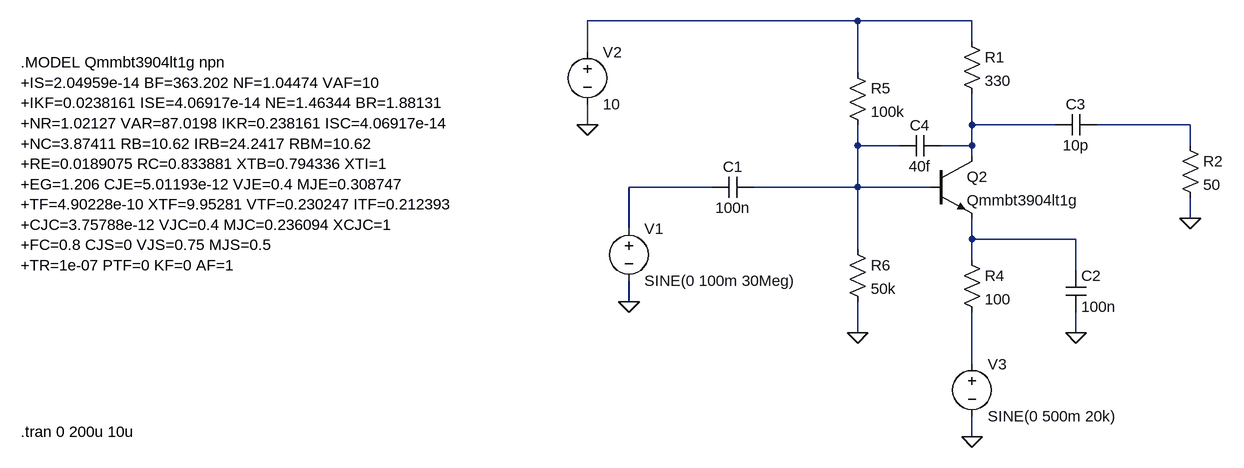
[diagram p0: schematic Mixer.asc]
Mixer.asc, the LTspice schematic file:
Version 4
SHEET 1 2992 1448
WIRE 1344 48 928 48
WIRE 1520 48 1344 48
WIRE 1520 80 1520 48
WIRE 928 96 928 48
WIRE 1344 128 1344 48
WIRE 928 208 928 176
WIRE 1520 208 1520 160
WIRE 1648 208 1520 208
WIRE 1856 208 1712 208
WIRE 1344 240 1344 208
WIRE 1408 240 1344 240
WIRE 1520 240 1520 208
WIRE 1520 240 1472 240
WIRE 1856 240 1856 208
WIRE 1520 256 1520 240
WIRE 1120 304 992 304
WIRE 1344 304 1344 240
WIRE 1344 304 1184 304
WIRE 1456 304 1344 304
WIRE 1856 352 1856 320
WIRE 992 368 992 304
WIRE 1520 384 1520 352
WIRE 1680 384 1520 384
WIRE 1344 400 1344 304
WIRE 1520 416 1520 384
WIRE 1680 432 1680 384
WIRE 992 480 992 448
WIRE 1344 528 1344 480
WIRE 1680 528 1680 496
WIRE 1520 576 1520 496
WIRE 1520 688 1520 656
FLAG 1344 528 0
FLAG 928 208 0
FLAG 1520 688 0
FLAG 992 480 0
FLAG 1680 528 0
FLAG 1856 352 0
SYMBOL npn 1456 256 R0
SYMATTR InstName Q2
SYMATTR Value Qmmbt3904lt1g
SYMBOL res 1504 400 R0
SYMATTR InstName R4
SYMATTR Value 100
SYMBOL res 1328 112 R0
SYMATTR InstName R5
SYMATTR Value 100k
SYMBOL res 1328 384 R0
SYMATTR InstName R6
SYMATTR Value 50k
SYMBOL voltage 928 80 R0
WINDOW 123 0 0 Left 0
WINDOW 39 0 0 Left 0
SYMATTR InstName V2
SYMATTR Value 10
SYMBOL voltage 992 352 R0
WINDOW 123 0 0 Left 0
WINDOW 39 0 0 Left 0
SYMATTR InstName V1
SYMATTR Value SINE(0 100m 30Meg)
SYMBOL cap 1664 432 R0
SYMATTR InstName C2
SYMATTR Value 100n
SYMBOL voltage 1520 560 R0
WINDOW 123 0 0 Left 0
WINDOW 39 0 0 Left 0
SYMATTR InstName V3
SYMATTR Value SINE(0 500m 20k)
SYMBOL cap 1712 192 R90
WINDOW 0 0 32 VBottom 2
WINDOW 3 32 32 VTop 2
SYMATTR InstName C3
SYMATTR Value 10p
SYMBOL res 1840 224 R0
SYMATTR InstName R2
SYMATTR Value 50
SYMBOL cap 1184 288 R90
WINDOW 0 0 32 VBottom 2
WINDOW 3 32 32 VTop 2
SYMATTR InstName C1
SYMATTR Value 100n
SYMBOL res 1504 64 R0
SYMATTR InstName R1
SYMATTR Value 330
SYMBOL cap 1472 224 R90
WINDOW 0 0 32 VBottom 2
WINDOW 3 32 32 VTop 2
SYMATTR InstName C4
SYMATTR Value 40f
TEXT 56 112 Left 2 !.MODEL Qmmbt3904lt1g npn\n+IS=2.04959e-14 BF=363.202 NF=1.04474 VAF=10\n+IKF=0.0238161 ISE=4.06917e-14 NE=1.46344 BR=1.88131\n+NR=1.02127 VAR=87.0198 IKR=0.238161 ISC=4.06917e-14\n+NC=3.87411 RB=10.62 IRB=24.2417 RBM=10.62\n+RE=0.0189075 RC=0.833881 XTB=0.794336 XTI=1\n+EG=1.206 CJE=5.01193e-12 VJE=0.4 MJE=0.308747\n+TF=4.90228e-10 XTF=9.95281 VTF=0.230247 ITF=0.212393\n+CJC=3.75788e-12 VJC=0.4 MJC=0.236094 XCJC=1\n+FC=0.8 CJS=0 VJS=0.75 MJS=0.5\n+TR=1e-07 PTF=0 KF=0 AF=1
TEXT 56 680 Left 2 !.tran 0 200u 10u

The netlist it stands for:
* Mixer.asc
Q2 N002 N004 N006 0 Qmmbt3904lt1g
R4 N006 N007 100
R5 N001 N004 100k
R6 N004 0 50k
V2 N001 0 10
V1 N005 0 SINE(0 100m 30Meg)
C2 N006 0 100n
V3 N007 0 SINE(0 500m 20k)
C3 N003 N002 10p
R2 N003 0 50
C1 N004 N005 100n
R1 N001 N002 330
C4 N002 N004 40f
.model NPN NPN
.model PNP PNP
.lib standard.bjt
.MODEL Qmmbt3904lt1g npn
+IS=2.04959e-14 BF=363.202 NF=1.04474 VAF=10
+IKF=0.0238161 ISE=4.06917e-14 NE=1.46344 BR=1.88131
+NR=1.02127 VAR=87.0198 IKR=0.238161 ISC=4.06917e-14
+NC=3.87411 RB=10.62 IRB=24.2417 RBM=10.62
+RE=0.0189075 RC=0.833881 XTB=0.794336 XTI=1
+EG=1.206 CJE=5.01193e-12 VJE=0.4 MJE=0.308747
+TF=4.90228e-10 XTF=9.95281 VTF=0.230247 ITF=0.212393
+CJC=3.75788e-12 VJC=0.4 MJC=0.236094 XCJC=1
+FC=0.8 CJS=0 VJS=0.75 MJS=0.5
+TR=1e-07 PTF=0 KF=0 AF=1
.tran 0 200u 10u
.backanno
.end